# EAGLE design C30 Pocket Console (EAGLE 6.2)
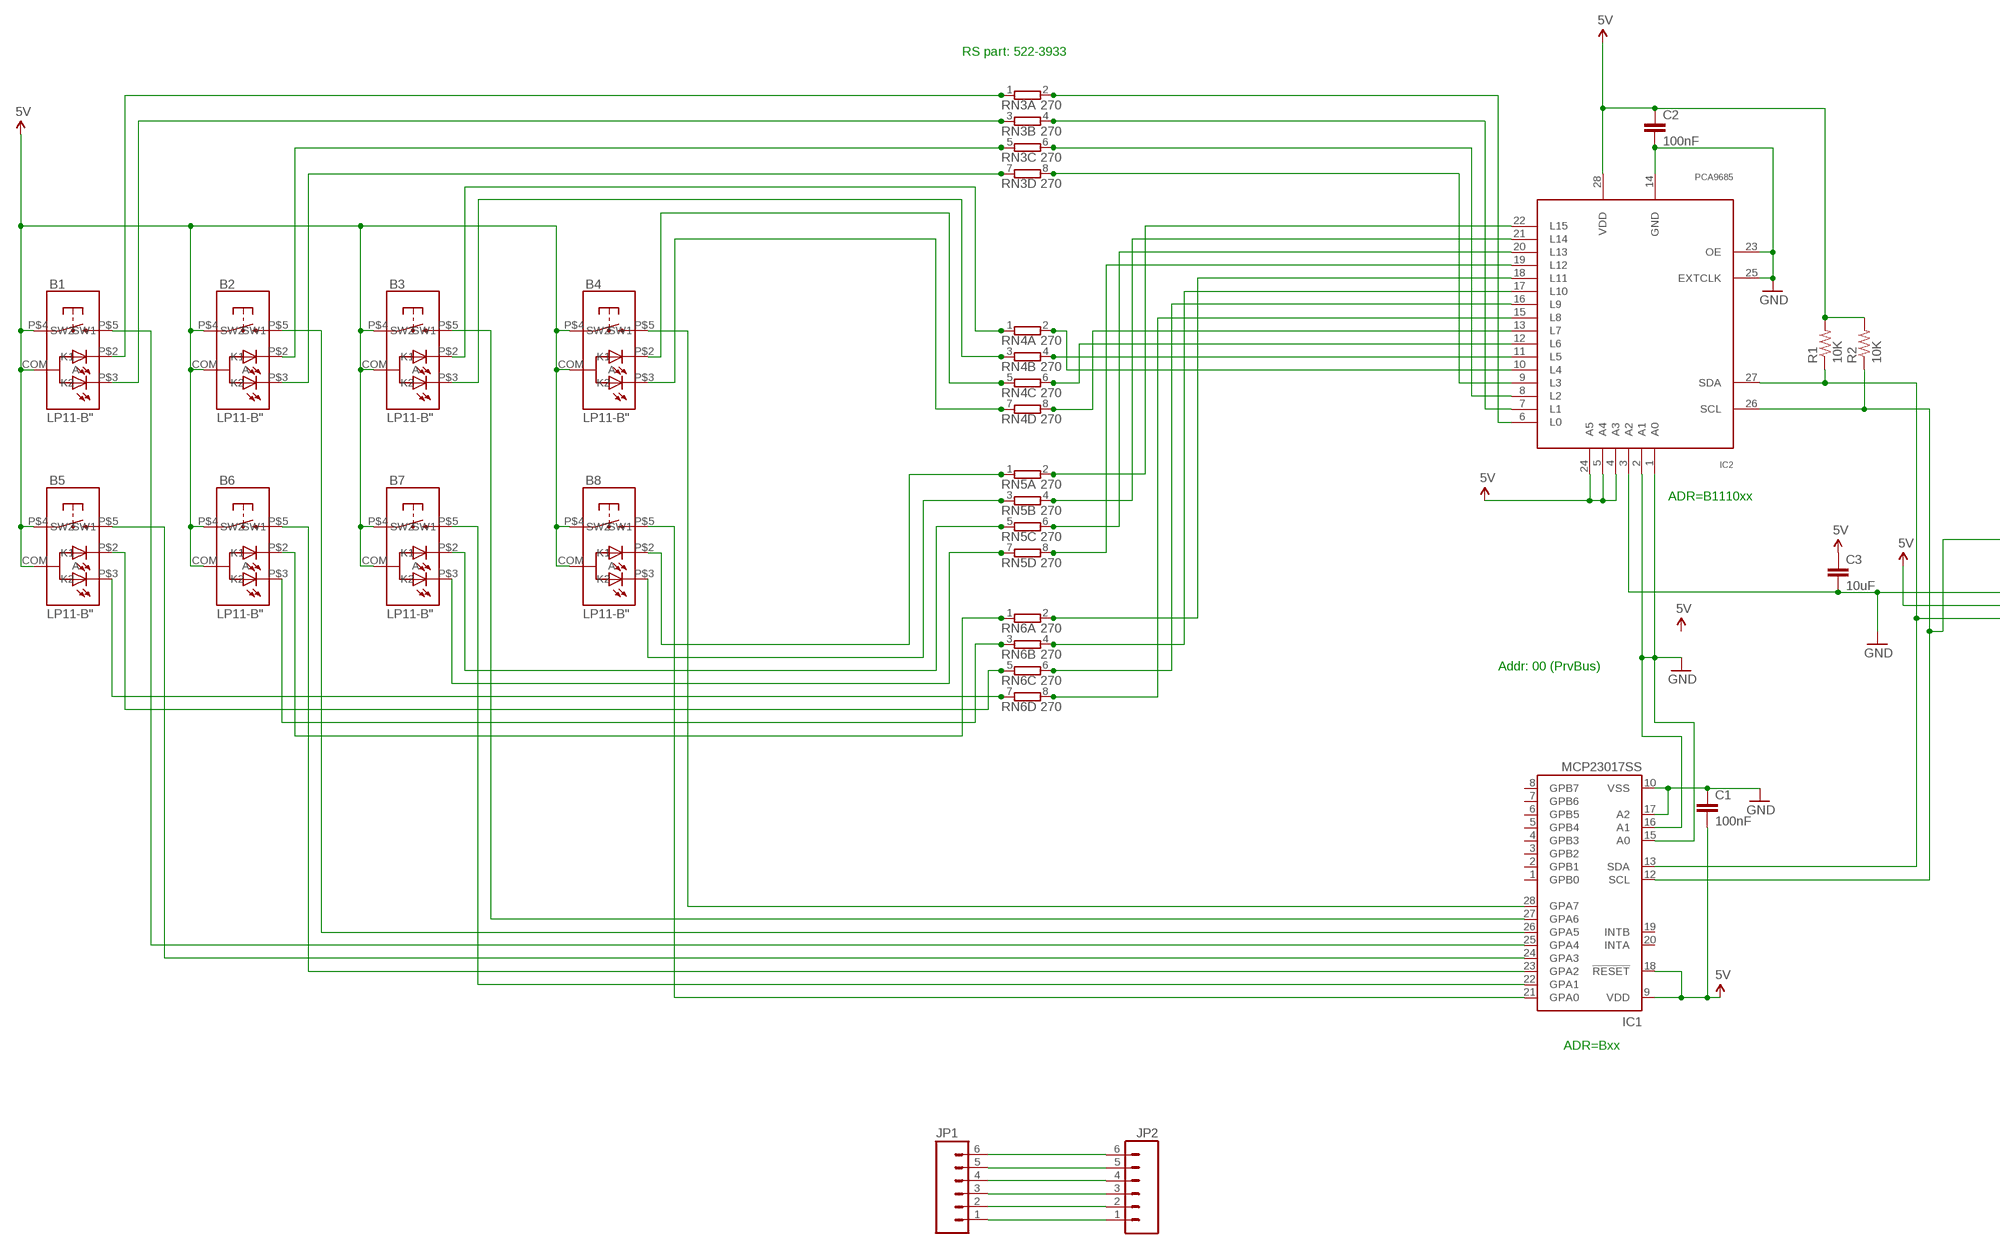
[diagram p0: schematic, sheet 1, part 1 of 2]
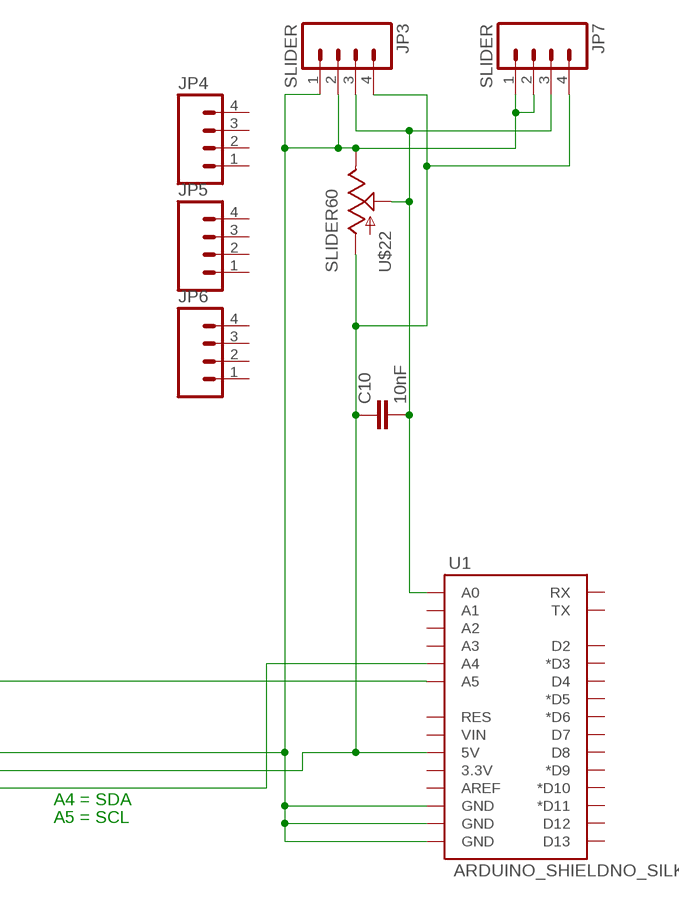
[diagram p1: schematic, sheet 1, part 2 of 2]

## Parts
B1  LP11-B"  [LP11]
B2  LP11-B"  [LP11]
B3  LP11-B"  [LP11]
B4  LP11-B"  [LP11]
B5  LP11-B"  [LP11]
B6  LP11-B"  [LP11]
B7  LP11-B"  [LP11]
B8  LP11-B"  [LP11]
C1  100nF  CAP_  [AXIAL-5MM]
C2  100nF  CAP_  [AXIAL-5MM]
C3  10uF  CAP_  [AXIAL-5MM]
C10  10nF  CAP_  [AXIAL-5MM]
IC1  MCP23017SS  [SSOP28]
IC2  PCA9685  [TSSOP28]
JP1  M06POLAR  [MOLEX-1X6]
JP2  M06POLAR  [MOLEX-1X6]
JP3  SLIDER  M04PTH  [1X04]
JP4  M04PTH  [1X04]
JP5  M04PTH  [1X04]
JP6  M04PTH  [1X04]
JP7  SLIDER  M04PTH  [1X04]
R1  10K  RESISTOR0603-RES  [0603-RES]
R2  10K  RESISTOR0603-RES  [0603-RES]
RN3  270  E4R  [SIL8]
RN4  270  E4R  [SIL8]
RN5  270  E4R  [SIL8]
RN6  270  E4R  [SIL8]
U1  ARDUINO_SHIELDNO_SILK  [DUEMILANOVE_VIAS]
U$22  SLIDER60  [SLIDER60]

## Nets
5V [Power]: B1.COM(A) B1.P$4(SW1) B2.COM(A) B2.P$4(SW1) B3.COM(A) B3.P$4(SW1) B4.COM(A) B4.P$4(SW1) B5.COM(A) B5.P$4(SW1) B6.COM(A) B6.P$4(SW1) B7.COM(A) B7.P$4(SW1) B8.COM(A) B8.P$4(SW1) C1.P$2 C2.P$1 C3.P$1 C10.P$1 IC1.9(VDD) IC1.18(!RESET) IC2.4(A3) IC2.5(A4) IC2.24(A5) IC2.28(VDD) JP3.4 JP7.4 R1.2 R2.2 U1.5V U$22.3(A)
GND [Power]: C1.P$1 C2.P$2 C3.P$2 IC1.10(VSS) IC1.15(A0) IC1.16(A1) IC1.17(A2) IC2.1(A0) IC2.2(A1) IC2.3(A2) IC2.14(GND) IC2.23(OE) IC2.25(EXTCLK) JP3.1 JP3.2 JP7.1 JP7.2 U1.GND@0(GND) U1.GND@1(GND) U1.GND@2(GND) U$22.1(E)
N$1: JP1.1 JP2.1
N$2: B7.P$3(K2) RN5.7
N$3: JP1.2 JP2.2
N$4: B2.P$2(K1) RN3.5
N$5: B2.P$3(K2) RN3.7
N$6: JP1.3 JP2.3
N$7: B1.P$2(K1) RN3.1
N$8: B1.P$3(K2) RN3.3
N$9: IC2.6(L0) RN3.2
N$10: IC2.7(L1) RN3.4
N$11: IC2.8(L2) RN3.6
N$12: IC2.9(L3) RN3.8
N$13: IC2.10(L4) RN4.2
N$14: IC2.11(L5) RN4.4
N$15: IC2.12(L6) RN4.6
N$16: IC2.13(L7) RN4.8
N$17: B3.P$2(K1) RN4.1
N$18: B3.P$3(K2) RN4.3
N$19: B4.P$2(K1) RN4.5
N$20: B4.P$3(K2) RN4.7
N$21: IC2.19(L12) RN5.8
N$22: IC2.20(L13) RN5.6
N$23: IC2.21(L14) RN5.4
N$24: IC2.22(L15) RN5.2
N$25: IC2.15(L8) RN6.8
N$26: IC2.16(L9) RN6.6
N$27: IC2.17(L10) RN6.4
N$28: IC2.18(L11) RN6.2
N$29: B5.P$3(K2) RN6.7
N$30: B5.P$2(K1) RN6.5
N$31: B6.P$3(K2) RN6.3
N$32: B6.P$2(K1) RN6.1
N$33: JP1.4 JP2.4
N$34: JP1.5 JP2.5
N$35: B8.P$3(K2) RN5.3
N$36: B8.P$2(K1) RN5.1
N$37: B1.P$5(SW2) IC1.25(GPA4)
N$38: B5.P$5(SW2) IC1.24(GPA3)
N$39: B6.P$5(SW2) IC1.23(GPA2)
N$40: B2.P$5(SW2) IC1.26(GPA5)
N$41: B8.P$5(SW2) IC1.21(GPA0)
N$42: B7.P$5(SW2) IC1.22(GPA1)
N$43: B4.P$5(SW2) IC1.28(GPA7)
N$44: B3.P$5(SW2) IC1.27(GPA6)
N$45: JP1.6 JP2.6
N$46: B7.P$2(K1) RN5.5
N$85: IC1.12(SCL) IC2.26(SCL) R2.1 U1.A5
N$86: IC1.13(SDA) IC2.27(SDA) R1.1 U1.A4
N$132: C10.P$2 JP3.3 JP7.3 U1.A0 U$22.2A(S)
Unconnected: IC1.1(GPB0) IC1.2(GPB1) IC1.3(GPB2) IC1.4(GPB3) IC1.5(GPB4) IC1.6(GPB5) IC1.7(GPB6) IC1.8(GPB7) IC1.19(INTB) IC1.20(INTA) JP4.1 JP4.2 JP4.3 JP4.4 JP5.1 JP5.2 JP5.3 JP5.4 JP6.1 JP6.2 JP6.3 JP6.4 U1.3.3V U1.A1 U1.A2 U1.A3 U1.AREF U1.D2 U1.D3(*D3) U1.D4 U1.D5(*D5) U1.D6(*D6) U1.D7 U1.D8 U1.D9(*D9) U1.D10(*D10) U1.D11(*D11) U1.D12 U1.D13 U1.RES U1.RX U1.TX U1.VIN

## Notes on the sheet
- RS part: 522-3933
- ADR=B1110xx
- A4 = SDA
- A5 = SCL
- Addr: 00 (PrvBus)
- ADR=Bxx

## Library data of the parts
B1-B8 = SKAARHOJ:LP11-B
C1-C3 C10 = SparkFun:CAP: Capacitor Standard 0603 ceramic capacitor, and 0.1" leaded capacitor.
IC1 = microchip:MCP23017: http://ww1.microchip.com/downloads/en/DeviceDoc/21952a.pdf Source: http://ww1.microchip.com/downloads/en/DeviceDoc/21952a.pdf; MF: MICROCHIP; MPN: MCP23017-E/SS; OC_FARNELL: 1467674; OC_NEWARK: 31K2960
IC2 = wsmith:PCA9685
JP1 JP2 = SparkFun:M06: Header 6 Standard 6-pin 0.1" header. Use with straight break away headers (SKU : PRT-00116), right angle break away headers (PRT-00553), swiss pins (PRT-00743), machine pins (PRT-00117), and female headers (PRT-00115). Molex polarized connector foot print use with SKU : PRT-08094 with associated crimp pins and housings. NOTES ON THE VARIANTS LOCK and LOCK_LONGPADS... This footprint was designed to help hold the alignment of a through-hole component (i.e. 6-pin header) while soldering it into place. You may notice that each hole has been shifted either up or down by 0.005 of an inch from it's more standard position (which is a perfectly straight line). This slight alteration caused the pins (the squares in the middle) to touch the edges of the holes. Because they are alternating, it causes a "brace" to hold the component in place. 0.005 has proven to be the perfect amount of "off-center" position when using our standard breakaway headers. Although looks a little odd when you look at the bare footprint, once you have a header in there, the alteration is very hard to notice. Also, if you push a header all the way into place, it is covered up entirely on the bottom side. This idea of altering the position of holes to aid alignment will be further integrated into the Sparkfun Library for other footprints. It can help hold any component with 3 or more connection pins.
JP3-JP7 = SparkFun:M04: Header 4 Standard 4-pin 0.1" header. Use with straight break away headers (SKU : PRT-00116), right angle break away headers (PRT-00553), swiss pins (PRT-00743), machine pins (PRT-00117), and female headers (PRT-00115). Molex polarized connector foot print use with SKU : PRT-08231 with associated crimp pins and housings. 1MM SMD Version SKU: PRT-10208
R1 R2 = SparkFun:RESISTOR: Resistor Basic schematic elements and footprints for 0603, 1206, and PTH resistors.
RN3-RN6 = resistor-sil:E4R: SIL RESISTOR; OC_FARNELL: unknown; OC_NEWARK: unknown
U1 = SparkFun:ARDUINO_SHIELD
U$22 = SKAARHOJ:SLIDER

## Net classes
0 default: width 0.203 mm, clearance 0.152 mm

## Board
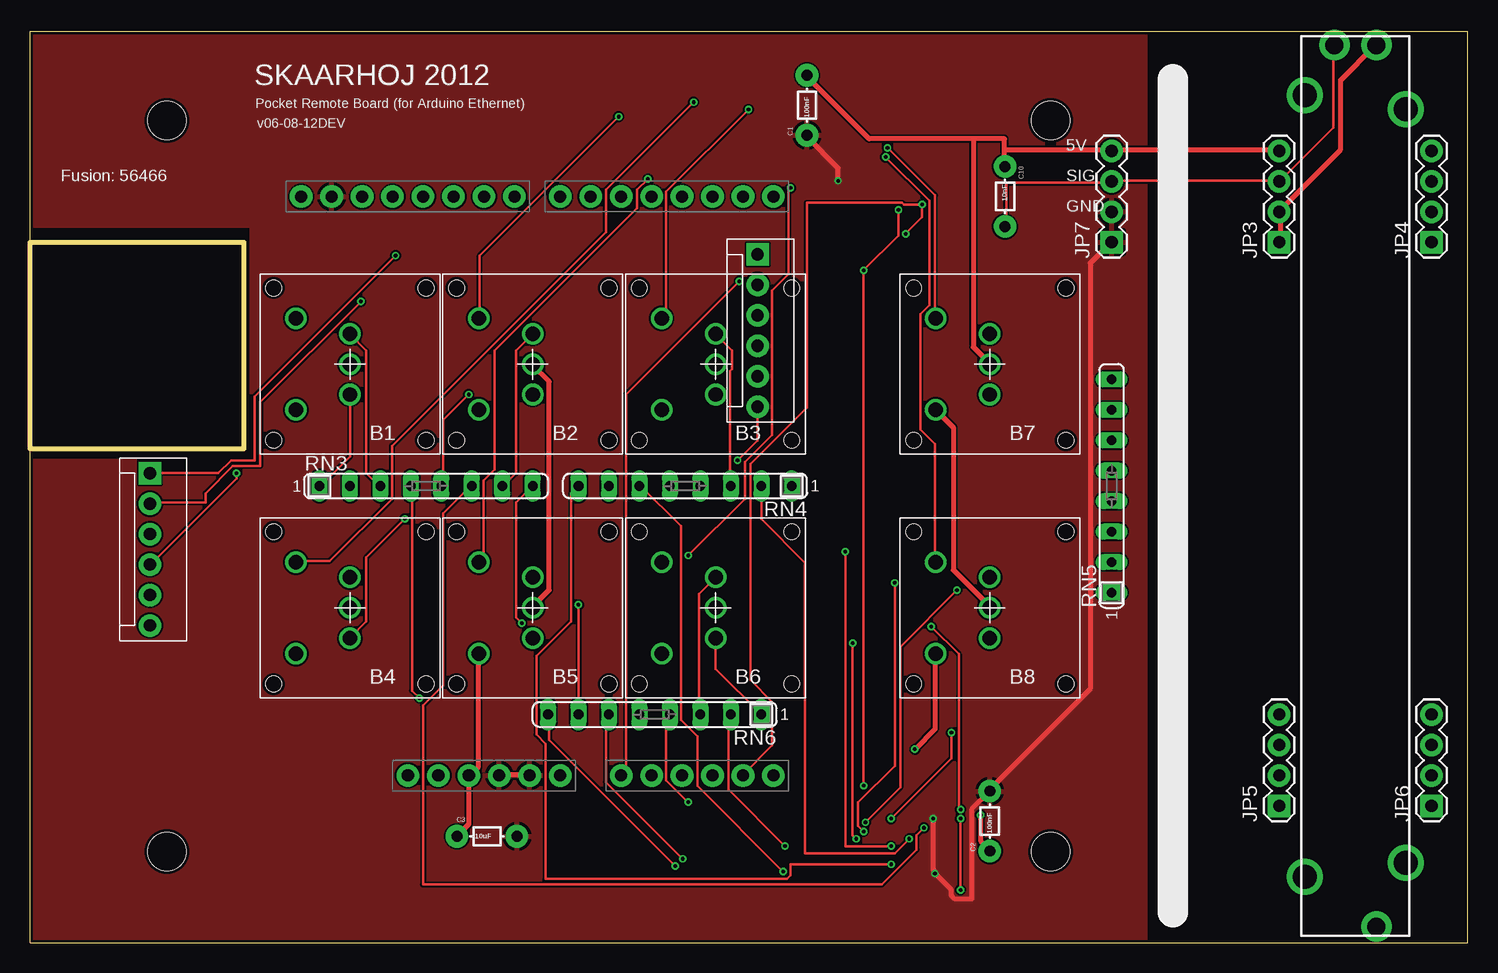
[diagram p2: board, top side]
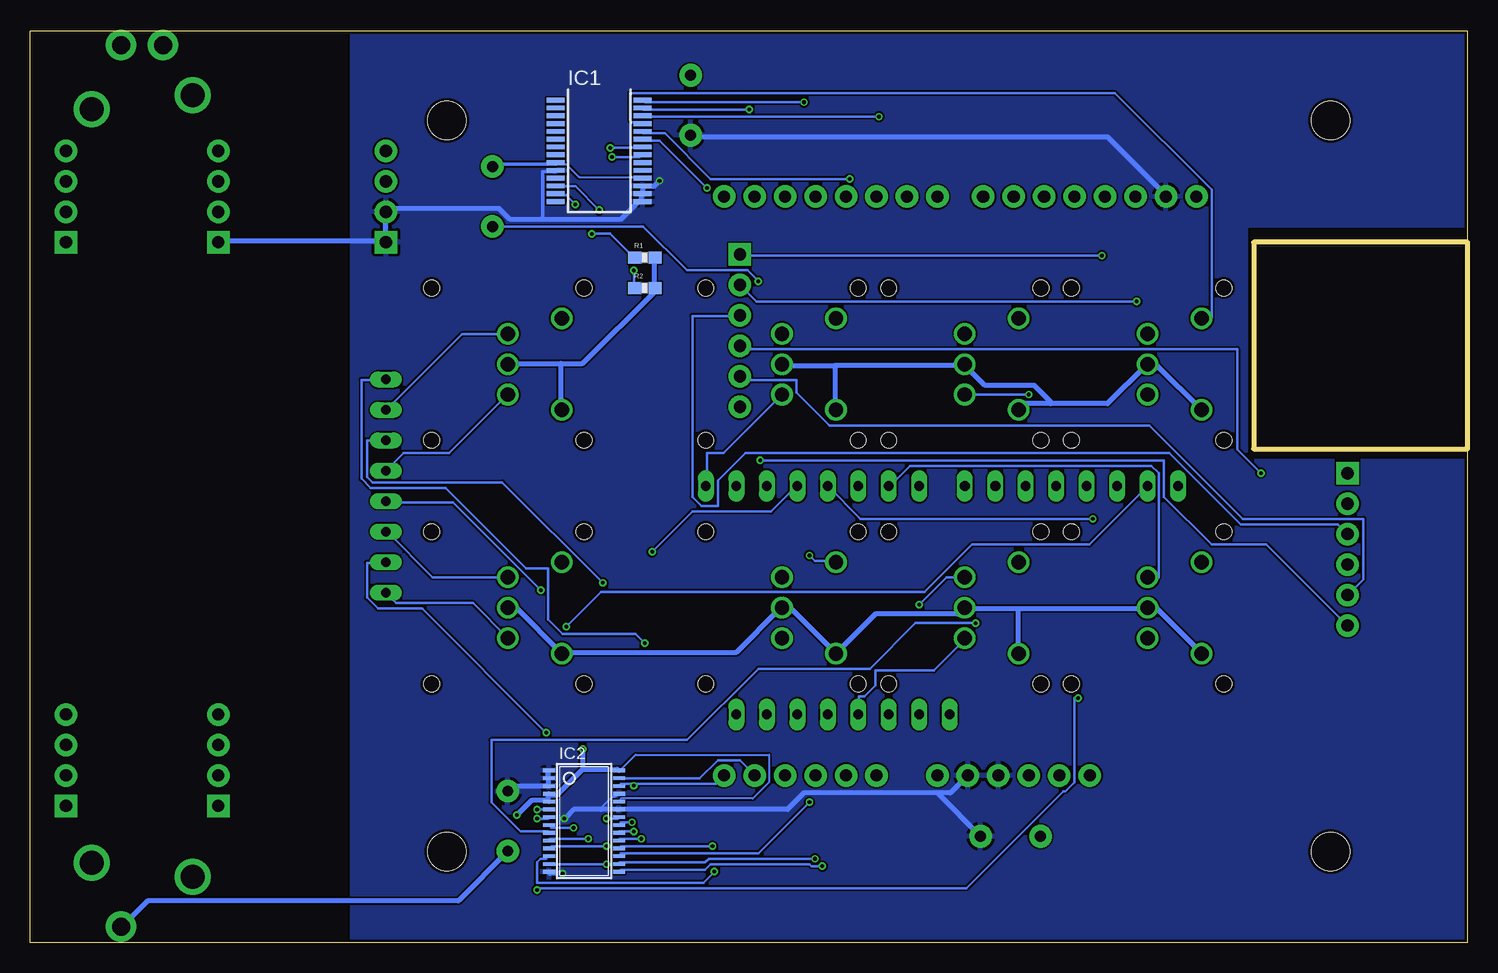
[diagram p3: board, bottom side, seen from below]

Size 119.84 x 76 mm. Coordinates in mm from the lower left corner, seen from the top.
Outline: 0,41.2 17.83,41.2 17.83,58.42 0,58.42 0,41.2
Outline: 0,41.2 0,0 119.84,0 119.84,76 0,76 0,41.2
Copper layers (1*16): Top 0.035mm / dielectric 1.5mm / Bottom 0.035mm
Design rules: minimum track width 6mil, minimum drill 12mil, track to track 6mil, track to pad 6mil, pad to pad 6mil, via to via 6mil, smd to smd 0mil, copper to edge 10mil, drill to drill 10mil, minimum pad ring 10mil, minimum via ring 6mil, stop-mask expansion 2mil, vias tented up to drill 100mil, thermal gap 10mil
Holes 3.2 mm at 11.43,7.62 11.43,68.58 85.09,68.58 85.09,7.62
tRestrict: area 0.2,40.4 to 18.3,59.6
bRestrict: area 0.2,40.4 to 18.3,59.6

### Footprints (pad centres in the part's own frame; a part is rotated, then mirrored left to right if it is on the bottom)
LP11 = drill 1.2: COM 0,0; P$2 0,2.54; P$3 0,-2.54; P$4 4.5,3.81; P$5 4.5,-3.81 | hole 1.3: -6.35,6.35; 6.35,6.35; 6.35,-6.35; -6.35,-6.35
AXIAL-5MM = drill 0.9 pad 1.88: P$1 -2.5,0; P$2 2.5,0
SSOP28 = smd 0.4 x 1.5: 1 -4.225,-3.625; 2 -3.575,-3.625; 3 -2.925,-3.625; 4 -2.275,-3.625; 5 -1.625,-3.625; 6 -0.975,-3.625; 7 -0.325,-3.625; 8 0.325,-3.625; 9 0.975,-3.625; 10 1.625,-3.625; 11 2.275,-3.625; 12 2.925,-3.625; 13 3.575,-3.625; 14 4.225,-3.625; 15 4.225,3.625; 16 3.575,3.625; 17 2.925,3.625; 18 2.275,3.625; 19 1.625,3.625; 20 0.975,3.625; 21 0.325,3.625; 22 -0.325,3.625; 23 -0.975,3.625; 24 -1.625,3.625; 25 -2.275,3.625; 26 -2.925,3.625; 27 -3.575,3.625; 28 -4.225,3.625
TSSOP28 = smd 0.305 x 0.991: 1 -4.225,-2.918; 2 -3.575,-2.918; 3 -2.925,-2.918; 4 -2.275,-2.918; 5 -1.625,-2.918; 6 -0.975,-2.918; 7 -0.325,-2.918; 8 0.325,-2.918; 9 0.975,-2.918; 10 1.625,-2.918; 11 2.275,-2.918; 12 2.925,-2.918; 13 3.575,-2.918; 14 4.225,-2.918; 15 4.225,2.918; 16 3.575,2.918; 17 2.925,2.918; 18 2.275,2.918; 19 1.625,2.918; 20 0.975,2.918; 21 0.325,2.918; 22 -0.325,2.918; 23 -0.975,2.918; 24 -1.625,2.918; 25 -2.275,2.918; 26 -2.925,2.918; 27 -3.575,2.918; 28 -4.225,2.918
MOLEX-1X6 = drill 1.016 pad 1.88 square: 1 0,0 | drill 1.016 pad 1.88: 2 2.54,0; 3 5.08,0; 4 7.62,0; 5 10.16,0; 6 12.7,0
1X04 = drill 1.016 pad 1.88 square: 1 0,0 | drill 1.016 pad 1.88: 2 2.54,0; 3 5.08,0; 4 7.62,0
0603-RES = smd 1.1 x 1: 1 -0.85,0; 2 0.85,0
SIL8 = drill 0.813 long: 1 -8.89,0; 2 -6.35,0; 3 -3.81,0; 4 -1.27,0; 5 1.27,0; 6 3.81,0; 7 6.35,0; 8 8.89,0
DUEMILANOVE_VIAS = drill 1.016 pad 1.88: 3.3V 50.8,13.97; 5V 50.8,16.51; A0 50.8,29.21; A1 50.8,31.75; A2 50.8,34.29; A3 50.8,36.83; A4 50.8,39.37; A5 50.8,41.91; AREF 2.54,2.54; D2 2.54,36.83; D3 2.54,34.29; D4 2.54,31.75; D5 2.54,29.21; D6 2.54,26.67; D7 2.54,24.13; D8 2.54,20.32; D9 2.54,17.78; D10 2.54,15.24; D11 2.54,12.7; D12 2.54,10.16; D13 2.54,7.62; GND@0 50.8,19.05; GND@1 50.8,21.59; GND@2 2.54,5.08; RES 50.8,11.43; RX 2.54,41.91; TX 2.54,39.37; VIN 50.8,24.13
SLIDER60 = drill 1.5 pad 2.54: 1 -36.75,1.75; 2A -36.75,-1.75; 3 36.75,1.75 | drill 2: P$1 -31.4,4.2; P$2 31.4,4.2; P$3 32.6,-4.2; P$4 -32.6,-4.2

### Placement (x,y rotation side)
B1  26.67,48.26 180 top
B2  41.91,48.26 180 top
B3  57.15,48.26 180 top
B4  26.67,27.94 180 top
B5  41.91,27.94 180 top
B6  57.15,27.94 180 top
B7  80.01,48.26 180 top
B8  80.01,27.94 180 top
C1  64.77,69.85 90 top
C2  80.01,10.16 90 top
C3  38.1,8.89 0 top
C10  81.28,62.23 270 top
IC1  72.39,66.04 270 bottom
IC2  73.66,10.16 270 bottom
JP1  60.66,57.4 270 top
JP2  10,39.17 270 top
JP3  104.14,58.42 90 top
JP4  116.84,58.42 90 top
JP5  104.14,11.43 90 top
JP6  116.84,11.43 90 top
JP7  90.17,58.42 90 top
R1  68.58,57.15 0 bottom
R2  68.58,54.61 0 bottom
RN3  33.02,38.1 0 top
RN4  54.61,38.1 180 top
RN5  90.17,38.1 90 top
RN6  52.07,19.05 180 top
U1  20.07,64.77 270 top
U$22  110.49,38.1 270 top

### Tracks (layer width: path | path; a pad name or v marks a point on that pad's centre or on a via)
5V  (via drill 0.3)
  Top 0.406: C3.P$1 35.66,8.99 36.58,9.91 U1.5V 36.73,14.02 37.34,14.63 37.34,24.08 B5.P$4 | B2.COM 41.91,48.16 43.28,46.79 43.28,29.41 41.91,28.04 B5.COM | v79.25,10.67 79.25,8.53 80.01,7.77 C2.P$1 | B8.COM 80.01,28.04 76.96,31.09 76.96,42.98 75.59,44.35 B7.P$4 | 78.64,67.06 81.23,67.06 81.23,66.14 | 78.64,67.06 69.95,67.06 64.77,72.24 C1.P$2 | 81.23,66.14 81.23,64.77 C10.P$1 | 81.23,66.14 90.07,66.14 JP7.4 90.22,66.14 104.09,66.14 JP3.4 | 78.64,67.06 78.64,49.68 80.01,48.31 B7.COM | v73.76,16.15 75.44,17.83 75.44,24.08 B8.P$4
  Bottom 0.152: IC1.18 68.89,63.86 74.07,63.86 75.13,64.92 75.89,64.92 IC1.9 76.05,64.92 | IC2.24 70.71,11.89 70.56,12.04 59.59,12.04 58.22,13.41 58.22,15.7 69.34,15.7 70.56,14.48 IC2.28 | 81.08,64.92 81.23,64.77 C10.P$1
  Bottom 0.305: 81.08,64.92 76.05,64.92
  Bottom 0.406: 52.73,48.16 52.73,44.5 B3.P$4 | 52.73,48.16 57.15,48.16 B3.COM | B1.P$4 22.25,44.5 25.91,48.16 26.67,48.16 B1.COM 26.82,48.16 30.02,44.96 34.75,44.96 | 34.75,44.96 36.88,44.96 37.34,44.5 B2.P$4 | 34.75,44.96 34.75,45.11 36.12,46.48 40.23,46.48 41.91,48.16 B2.COM 42.06,48.16 52.73,48.16 | B4.P$4 22.25,24.23 25.91,27.89 26.67,27.89 B4.COM 26.82,27.89 37.49,27.89 | 37.49,27.89 37.49,24.23 B5.P$4 | 37.49,27.89 41.91,27.89 B5.COM 42.06,27.89 42.52,27.43 49.38,27.43 52.58,24.23 B6.P$4 52.73,24.23 56.39,27.89 57.15,27.89 B6.COM 57.3,27.89 60.96,24.23 75.44,24.23 B8.P$4 75.59,24.23 79.25,27.89 80.01,27.89 B8.COM | 73.76,14.48 70.87,14.48 IC2.28 | 73.76,14.48 75.89,12.34 76.5,12.34 IC2.4 76.66,12.34 76.66,11.89 IC2.5 76.81,11.89 78.03,11.89 v79.25,10.67 | U$22.3 112.17,1.37 110.03,3.5 84.12,3.5 80.01,7.62 C2.P$1 | R1.2 67.82,57.15 67.82,54.71 R2.2 67.67,54.41 73.76,48.31 75.59,48.31 | 75.59,48.31 80.01,48.31 B7.COM | 75.59,48.31 75.59,44.5 B7.P$4 | v73.76,16.15 73.76,14.48
GND  (via drill 0.3)
  Top 0.406: U1.GND@0 39.17,14.02 41.6,14.02 U1.GND@1 | v75.29,10.36 75.29,6.1 75.44,5.94 v75.44,5.79 76.81,4.42 76.81,3.96 77.11,3.66 78.49,3.66 78.49,11.12 80.01,12.65 C2.P$2 80.01,12.8 88.39,21.18 88.39,56.69 90.07,58.37 JP7.1 | JP3.1 104.24,58.52 104.24,60.96 JP3.2 104.24,61.11 109.27,66.14 109.27,71.93 112.17,74.83 U$22.1 | v67.36,63.55 67.36,64.62 64.77,67.21 C1.P$1
  Bottom 0.152: IC2.25 70.87,12.34 71.02,12.19 71.32,12.19 72.24,11.28 72.24,11.12 | 76.05,64.31 IC1.10
  Bottom 0.305: 77.11,60.35 77.11,64.31 76.05,64.31
  Bottom 0.406: IC2.1 76.66,14.33 76.66,13.87 IC2.2 76.66,13.72 76.66,13.11 IC2.3 76.81,13.11 79.7,13.11 80.01,12.8 C2.P$2 | v75.44,5.79 76.5,5.79 IC2.14 | 44.04,12.5 43.13,12.5 U1.GND@1 | 44.04,12.5 55.32,12.5 56.69,11.12 70.71,11.12 IC2.23 70.87,11.12 72.24,11.12 74.52,11.12 v75.29,10.36 | C3.P$2 40.69,8.99 44.04,12.34 44.04,12.5 | U1.GND@2 25.15,62.33 30.02,67.21 64.77,67.21 C1.P$1 | JP3.1 104.09,58.52 90.37,58.52 JP7.1 90.22,58.52 90.22,60.81 JP7.2 90.07,60.96 89.76,61.27 80.77,61.27 79.86,60.35 77.11,60.35 70.56,60.35 69.04,61.87 IC1.15 68.89,61.87 68.89,62.33 IC1.16 68.73,62.64 68.73,63.09 IC1.17 68.58,63.09 67.82,63.09 v67.36,63.55
  pour Top: 0,0 92.96,0 92.96,75.95 0,75.95
  pour Bottom: 0,0 92.96,0 92.96,75.95 0,75.95
N$1  (via drill 0.3)
  Top 0.203: JP2.1 15.7,39.17 16.76,40.23 18.75,40.23 18.75,45.57 v30.48,57.3
  Bottom 0.203: v30.48,57.3 60.66,57.3 JP1.1
N$2
  Bottom 0.203: RN5.7 90.07,44.5 83.82,50.75 80.01,50.75 B7.P$3
N$3  (via drill 0.3)
  Top 0.203: v27.58,53.49 19.2,45.11 19.2,39.78 16.92,39.78 14.63,37.49 14.63,36.73 10.06,36.73 JP2.2
  Bottom 0.203: v27.58,53.49 59.28,53.49 JP1.2
N$4  (via drill 0.3)
  Top 0.203: RN3.5 34.44,38.25 34.44,43.59 v36.58,45.72
  Bottom 0.203: B2.P$2 v36.58,45.72
N$5
  Top 0.203: RN3.7 39.47,38.1 40.54,39.17 40.54,49.38 41.91,50.75 B2.P$3
N$6
  Bottom 0.203: JP2.3 10.06,34.14 10.82,34.9 18.9,34.9 24.84,40.84 60.2,40.84 62.48,38.56 62.48,36.42 63.86,36.42 64.62,37.19 64.62,52.27 60.66,52.27 JP1.3
N$7
  Top 0.203: B1.P$2 26.67,40.54 24.23,38.1 RN3.1
N$8
  Top 0.203: RN3.3 29.11,38.1 28.04,39.17 28.04,49.38 26.67,50.75 B1.P$3
N$9  (via drill 0.3)
  Top 0.203: v77.57,11.12 77.42,11.28 77.42,24.08 v75.13,26.36
  Bottom 0.203: v77.57,11.12 76.66,11.12 IC2.6 | v75.13,26.36 72.24,29.26 45.26,29.26 41.3,33.22 31.55,33.22 RN3.2
N$10  (via drill 0.3)
  Top 0.203: v77.57,4.42 v77.57,10.36 | v32.46,20.42 31.85,21.03 31.85,38.1 RN3.4
  Bottom 0.203: v77.57,10.36 76.66,10.36 IC2.7 | v77.57,4.42 77.42,4.57 41.76,4.57 33.68,12.65 33.53,12.65 32.77,13.41 32.77,20.42 v32.46,20.42
N$11  (via drill 0.3)
  Top 0.203: v74.52,9.6 73.91,8.99 73.91,7.77 71.02,4.88 32.77,4.88 32.77,19.81 34.44,21.49 34.44,35.81 36.73,38.1 RN3.6
  Bottom 0.203: v74.52,9.6 76.35,9.6 76.5,9.75 IC2.8
N$12  (via drill 0.3)
  Top 0.203: v41,26.67 40.54,27.13 40.54,36.73 RN3.8
  Bottom 0.203: v41,26.67 46.02,26.67 49.84,22.86 59.13,22.86 65.08,16.92 81.38,16.92 81.38,11.73 78.94,9.3 76.66,9.3 IC2.9
N$13  (via drill 0.3)
  Top 0.203: v73.3,8.69 72.08,7.47 64.62,7.47 64.62,31.7 60.96,35.36 RN4.2
  Bottom 0.203: v73.3,8.69 76.5,8.69 IC2.10
N$14  (via drill 0.3)
  Top 0.203: v71.78,8.08 67.97,8.08 v67.97,32.61
  Bottom 0.203: v71.78,8.08 76.35,8.08 76.5,7.92 IC2.11 | v67.97,32.61 64.62,35.97 58.06,35.97 55.93,38.1 RN4.4
N$15  (via drill 0.3)
  Top 0.203: v62.79,5.94 55.63,13.11 55.63,17.22 54.25,18.59 54.25,34.75 50.9,38.1 RN4.6
  Bottom 0.203: v62.79,5.94 63.7,5.03 77.57,5.03 77.57,6.71 77.27,7.01 76.81,7.01 76.66,7.16 IC2.12
N$16  (via drill 0.3)
  Top 0.203: v71.78,6.55 63.4,6.55 63.4,5.64 63.09,5.33 42.98,5.33 42.98,16.61 42.22,17.37 42.22,23.93 45.11,26.82 45.11,37.49 RN4.8
  Bottom 0.203: v71.78,6.55 76.5,6.55 IC2.13
N$17
  Bottom 0.203: B3.P$2 62.03,40.84 63.4,40.84 63.4,38.1 RN4.1
N$18
  Top 0.203: RN4.3 58.37,38.1 58.37,47.7 58.52,47.85 58.52,49.38 57.15,50.75 B3.P$3
N$19  (via drill 0.3)
  Top 0.203: v31.24,35.36 28.04,32.16 28.04,26.82 26.67,25.45 B4.P$2
  Bottom 0.203: RN4.5 50.6,35.36 v31.24,35.36
N$20
  Bottom 0.203: B4.P$3 25.76,30.48 25.76,39.17 26.36,39.78 46.48,39.78 48.16,38.1 RN4.7
N$21  (via drill 0.3)
  Top 0.203: v68.89,8.69 68.58,8.99 v68.58,24.99
  Bottom 0.203: v68.89,8.69 70.71,8.69 IC2.19 | v68.58,24.99 69.34,25.76 75.44,25.76 76.66,26.98 76.66,31.24 78.49,31.24 85.19,37.95 91.44,37.95 92.2,38.71 92.2,46.94 90.22,46.94 RN5.8
N$22  (via drill 0.3)
  Top 0.203: v69.49,9.3 69.04,9.75 69.04,11.73 72.08,14.78 v72.08,30.02
  Bottom 0.203: v69.49,9.3 70.71,9.3 IC2.20 | v72.08,30.02 80.47,38.41 91.29,38.41 91.75,38.86 91.75,41.91 RN5.6
N$23  (via drill 0.3)
  Top 0.203: v69.65,10.06 72.54,12.95 72.54,24.69 v77.27,29.41
  Bottom 0.203: v69.65,10.06 70.56,10.06 70.71,9.91 IC2.21 | v77.27,29.41 84.58,36.73 90.07,36.73 RN5.4
N$24  (via drill 0.3)
  Top 0.203: v71.78,10.36 76.81,15.39 v76.81,17.53
  Bottom 0.203: v71.78,10.36 70.87,10.36 IC2.22 | v76.81,17.53 87.17,27.89 90.83,27.89 91.75,28.8 91.75,31.7 90.22,31.7 RN5.2
N$25  (via drill 0.3)
  Top 0.203: v53.8,6.4 43.28,16.92 43.28,19.05 RN6.8
  Bottom 0.203: v53.8,6.4 54.71,6.4 54.86,6.55 63.09,6.55 63.55,6.1 70.56,6.1 70.71,5.94 IC2.15
N$26  (via drill 0.3)
  Top 0.203: v54.41,7.01 48.01,13.41 48.01,18.9 48.16,19.05 RN6.6
  Bottom 0.203: v54.41,7.01 63.25,7.01 63.55,6.71 70.71,6.71 IC2.16
N$27  (via drill 0.3)
  Top 0.203: v54.86,11.73 53.03,13.56 53.03,18.75 RN6.4
  Bottom 0.203: v54.86,11.73 59.13,7.47 70.56,7.47 70.71,7.32 IC2.17
N$28  (via drill 0.3)
  Top 0.203: v62.94,8.08 58.22,12.8 58.22,18.9 58.37,19.05 RN6.2
  Bottom 0.203: v62.94,8.08 70.56,8.08 70.71,7.92 IC2.18
N$29  (via drill 0.3)
  Top 0.203: v45.72,28.19 RN6.7
  Bottom 0.203: v45.72,28.19 43.43,30.48 B5.P$3
N$30
  Bottom 0.203: RN6.5 50.75,19.05 50.75,20.57 50.29,20.57 49.38,21.49 49.38,22.71 44.5,22.71 41.91,25.3 B5.P$2
N$31
  Top 0.203: B6.P$3 55.78,29.11 55.78,19.05 RN6.3
N$32
  Top 0.203: RN6.1 57.15,22.86 B6.P$2
N$33  (via drill 0.3)
  Top 0.203: v17.22,39.17 17.22,38.71 10.06,31.55 JP2.4
  Bottom 0.203: v17.22,39.17 19.2,41.15 19.2,49.53 60.5,49.53 60.66,49.68 JP1.4
N$34
  Bottom 0.203: JP1.5 60.35,46.94 55.93,46.94 55.93,45.87 53.19,43.13 26.52,43.13 18.75,35.36 8.69,35.36 8.69,30.33 9.91,29.11 JP2.5
N$35
  Bottom 0.203: B8.P$3 86.26,30.48 90.07,34.29 RN5.3
N$36
  Bottom 0.203: RN5.1 89.31,28.35 82.91,28.35 80.01,25.45 B8.P$2
N$37
  Bottom 0.203: IC1.25 68.89,68.43 69.65,68.43 69.8,68.58 69.8,70.87 29.41,70.87 21.34,62.79 21.34,52.12 22.1,52.12 B1.P$5
N$38  (via drill 0.3)
  Top 0.203: v51.51,63.7 50.6,62.79 50.6,61.27 38.71,49.38 38.71,39.47 37.8,38.56 37.8,32.16 37.49,31.85 B5.P$5
  Bottom 0.203: v51.51,63.7 63.09,63.7 66.9,67.51 68.73,67.51 IC1.24
N$39  (via drill 0.3)
  Top 0.203: v63.4,62.94 63.25,62.79 63.25,55.78 61.87,54.41 61.87,42.37 59.59,40.08 59.59,37.03 v54.86,32.31
  Bottom 0.203: v63.4,62.94 67.36,66.9 68.73,66.9 IC1.23 | v54.86,32.31 54.41,31.85 52.73,31.85 B6.P$5
N$40  (via drill 0.3)
  Top 0.203: v49.07,68.89 37.49,57.3 37.49,52.12 B2.P$5
  Bottom 0.203: v49.07,68.89 68.73,68.89 IC1.26
N$41  (via drill 0.3)
  Top 0.203: v71.32,65.53 74.98,61.87 74.98,53.19 74.22,52.43 74.22,42.82 75.44,41.6 75.44,31.85 B8.P$5
  Bottom 0.203: v71.32,65.53 69.04,65.53 68.89,65.68 IC1.21
N$42  (via drill 0.3)
  Top 0.203: v71.48,66.29 75.44,62.33 75.44,52.12 B7.P$5
  Bottom 0.203: v71.48,66.29 68.89,66.29 IC1.22
N$43  (via drill 0.3)
  Top 0.203: v55.32,70.1 48.01,62.79 48.01,59.28 30.18,41.45 30.18,37.03 24.99,31.85 22.25,31.85 B4.P$5
  Bottom 0.203: v55.32,70.1 68.58,70.1 68.73,70.26 IC1.28
N$44  (via drill 0.3)
  Top 0.203: v59.89,69.49 53.03,62.64 53.03,52.43 52.73,52.12 B3.P$5
  Bottom 0.203: v59.89,69.49 68.73,69.49 IC1.27
N$45  (via drill 0.3)
  Top 0.203: v58.98,40.23 60.66,41.91 JP1.6
  Bottom 0.203: v58.98,40.23 25.3,40.23 25.3,37.19 21.34,33.22 16.76,33.22 10.06,26.52 JP2.6
N$46
  Bottom 0.203: RN5.5 88.7,40.84 84.89,40.84 B7.P$2
N$85  (via drill 0.3)
  Top 0.203: v72.39,61.11 72.39,58.98 v69.49,56.08 v69.49,13.11
  Bottom 0.203: 69.49,13.26 62.64,13.26 62.03,13.87 U1.A5 | 69.49,13.26 70.56,13.26 70.71,13.11 IC2.26 | v69.49,56.08 69.49,54.71 R2.1 | v72.39,61.11 74.37,63.09 75.89,63.09 IC1.12 | v69.49,13.11 69.49,13.26
N$86  (via drill 0.3)
  Top 0.203: v73,59.13 74.37,60.5 v74.37,61.57 72.85,61.57 72.69,61.72 64.77,61.72 64.77,44.65 60.05,39.93 60.05,21.95 61.87,20.12 61.87,16.46 59.44,14.02 U1.A4
  Bottom 0.203: v73,59.13 71.48,59.13 69.49,57.15 R1.1 | v74.37,61.57 75.13,62.33 75.89,62.33 IC1.13 | IC2.27 70.71,13.72 64.01,13.72 62.48,15.24 60.66,15.24 59.44,14.02 U1.A4
N$132  (via drill 0.3)
  Top 0.203: U$22.2A 108.66,74.83 108.66,67.97 104.24,63.55 JP3.3 104.09,63.55 90.22,63.55 JP7.3 90.07,63.4 81.38,63.4 81.38,59.74 C10.P$2 | v59.13,55.17 49.68,45.72 49.68,14.33 49.38,14.02 U1.A0
  Bottom 0.203: v59.13,55.17 60.05,56.08 65.08,56.08 68.73,59.74 81.23,59.74 C10.P$2

### Text on the board
_tsilk: SKAARHOJ 2012 | Pocket Remote Board (for Arduino Ethernet) | v06-08-12DEV | 5V | Fusion: 56466 | SIG | GND